# Altium schematic sheet MCPEmulate0.SchDoc
size A4; SheetNumber: 3; SheetTotal: 4
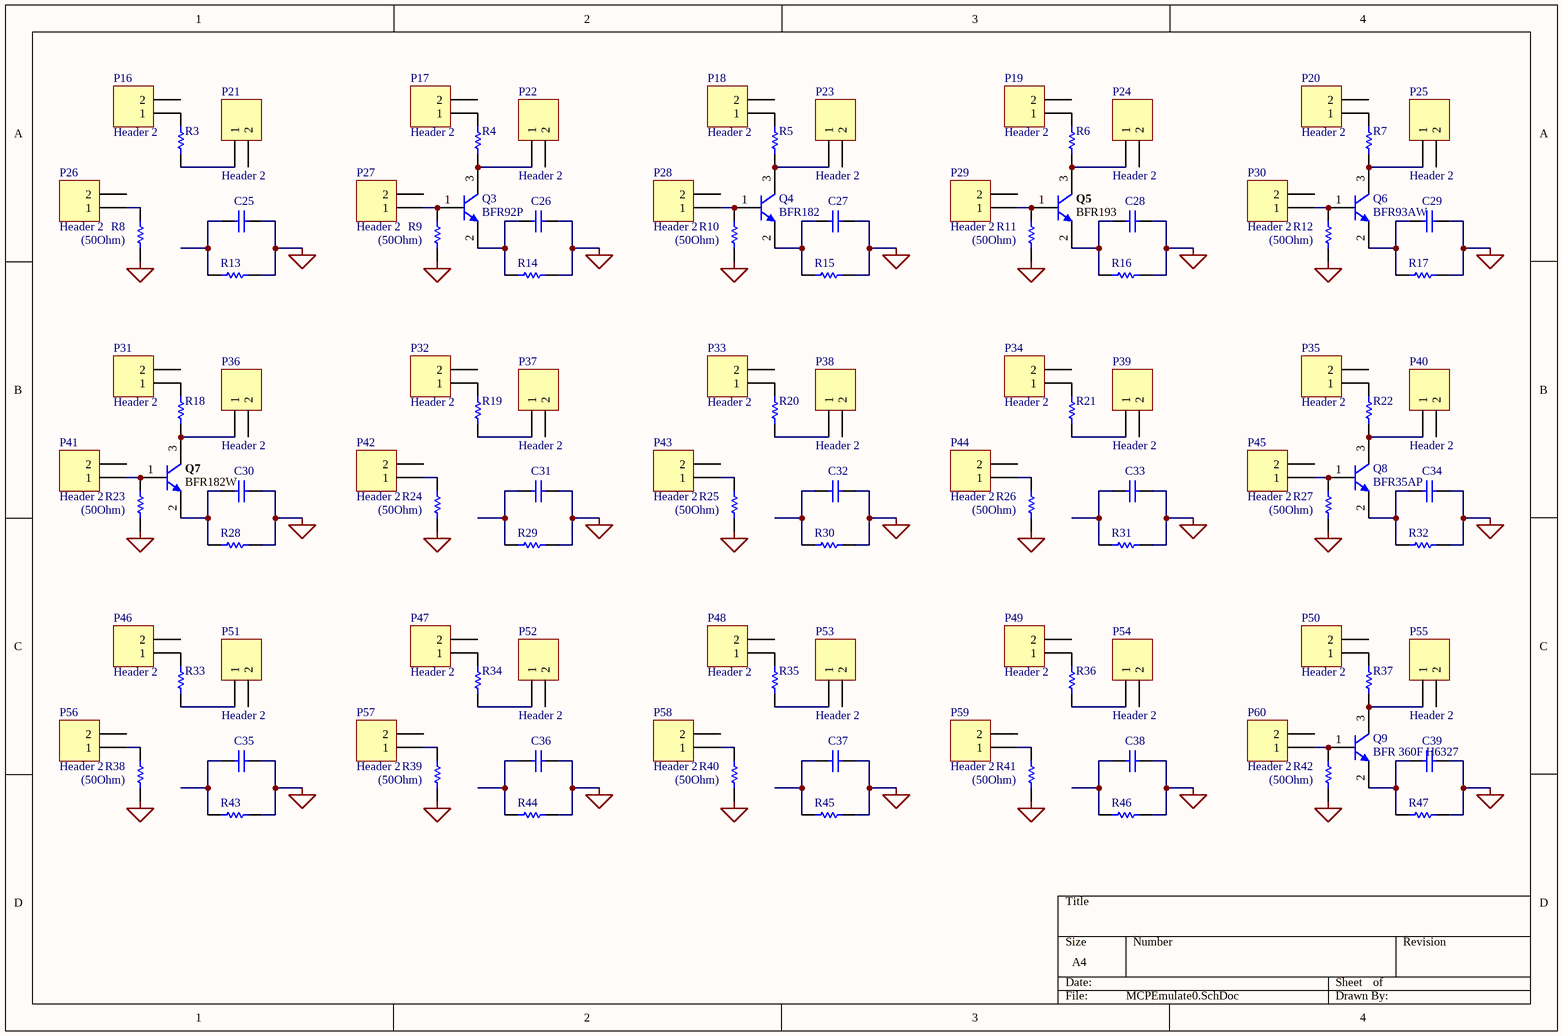
[diagram p0: MCPEmulate0.SchDoc]

## Parts
C25  (no value)  [CAPC2013X140X45NL15T25]
C26  (no value)  [CAPC2013X140X45NL15T25]
C27  (no value)  [CAPC2013X140X45NL15T25]
C28  (no value)  [CAPC2013X140X45NL15T25]
C29  (no value)  [CAPC2013X140X45NL15T25]
C30  (no value)  [CAPC2013X140X45NL15T25]
C31  (no value)  [CAPC2013X140X45NL15T25]
C32  (no value)  [CAPC2013X140X45NL15T25]
C33  (no value)  [CAPC2013X140X45NL15T25]
C34  (no value)  [CAPC2013X140X45NL15T25]
C35  (no value)  [CAPC2013X140X45NL15T25]
C36  (no value)  [CAPC2013X140X45NL15T25]
C37  (no value)  [CAPC2013X140X45NL15T25]
C38  (no value)  [CAPC2013X140X45NL15T25]
C39  (no value)  [CAPC2013X140X45NL15T25]
P16  Header 2  [HDR1X2]
P17  Header 2  [HDR1X2]
P18  Header 2  [HDR1X2]
P19  Header 2  [HDR1X2]
P20  Header 2  [HDR1X2]
P21  Header 2  [HDR1X2]
P22  Header 2  [HDR1X2]
P23  Header 2  [HDR1X2]
P24  Header 2  [HDR1X2]
P25  Header 2  [HDR1X2]
P26  Header 2  [HDR1X2]
P27  Header 2  [HDR1X2]
P28  Header 2  [HDR1X2]
P29  Header 2  [HDR1X2]
P30  Header 2  [HDR1X2]
P31  Header 2  [HDR1X2]
P32  Header 2  [HDR1X2]
P33  Header 2  [HDR1X2]
P34  Header 2  [HDR1X2]
P35  Header 2  [HDR1X2]
P36  Header 2  [HDR1X2]
P37  Header 2  [HDR1X2]
P38  Header 2  [HDR1X2]
P39  Header 2  [HDR1X2]
P40  Header 2  [HDR1X2]
P41  Header 2  [HDR1X2]
P42  Header 2  [HDR1X2]
P43  Header 2  [HDR1X2]
P44  Header 2  [HDR1X2]
P45  Header 2  [HDR1X2]
P46  Header 2  [HDR1X2]
P47  Header 2  [HDR1X2]
P48  Header 2  [HDR1X2]
P49  Header 2  [HDR1X2]
P50  Header 2  [HDR1X2]
P51  Header 2  [HDR1X2]
P52  Header 2  [HDR1X2]
P53  Header 2  [HDR1X2]
P54  Header 2  [HDR1X2]
P55  Header 2  [HDR1X2]
P56  Header 2  [HDR1X2]
P57  Header 2  [HDR1X2]
P58  Header 2  [HDR1X2]
P59  Header 2  [HDR1X2]
P60  Header 2  [HDR1X2]
Q3  BFR92P  [INF-SOT23_N]
Q4  BFR182  [INF-SOT23_M]
Q5  BFR193  [INF-SOT23_N]
Q6  BFR93AW  [INF-SOT323_M]
Q7  BFR182W  [INF-SOT323_L]
Q8  BFR35AP  [INF-SOT23_L]
Q9  BFR 360F H6327  [INF-PG-TSFP-3-1_V]
R3  (no value)  [RESC1005X40X25NL05T10]
R4  (no value)  [RESC1005X40X25NL05T10]
R5  (no value)  [RESC1005X40X25NL05T10]
R6  (no value)  [RESC1005X40X25NL05T10]
R7  (no value)  [RESC1005X40X25NL05T10]
R8  (50Ohm)  [RESC1005X40X25NL05T10]
R9  (50Ohm)  [RESC1005X40X25NL05T10]
R10  (50Ohm)  [RESC1005X40X25NL05T10]
R11  (50Ohm)  [RESC1005X40X25NL05T10]
R12  (50Ohm)  [RESC1005X40X25NL05T10]
R13  (no value)  [RESC1005X40X25NL05T10]
R14  (no value)  [RESC1005X40X25NL05T10]
R15  (no value)  [RESC1005X40X25NL05T10]
R16  (no value)  [RESC1005X40X25NL05T10]
R17  (no value)  [RESC1005X40X25NL05T10]
R18  (no value)  [RESC1005X40X25NL05T10]
R19  (no value)  [RESC1005X40X25NL05T10]
R20  (no value)  [RESC1005X40X25NL05T10]
R21  (no value)  [RESC1005X40X25NL05T10]
R22  (no value)  [RESC1005X40X25NL05T10]
R23  (50Ohm)  [RESC1005X40X25NL05T10]
R24  (50Ohm)  [RESC1005X40X25NL05T10]
R25  (50Ohm)  [RESC1005X40X25NL05T10]
R26  (50Ohm)  [RESC1005X40X25NL05T10]
R27  (50Ohm)  [RESC1005X40X25NL05T10]
R28  (no value)  [RESC1005X40X25NL05T10]
R29  (no value)  [RESC1005X40X25NL05T10]
R30  (no value)  [RESC1005X40X25NL05T10]
R31  (no value)  [RESC1005X40X25NL05T10]
R32  (no value)  [RESC1005X40X25NL05T10]
R33  (no value)  [RESC1005X40X25NL05T10]
R34  (no value)  [RESC1005X40X25NL05T10]
R35  (no value)  [RESC1005X40X25NL05T10]
R36  (no value)  [RESC1005X40X25NL05T10]
R37  (no value)  [RESC1005X40X25NL05T10]
R38  (50Ohm)  [RESC1005X40X25NL05T10]
R39  (50Ohm)  [RESC1005X40X25NL05T10]
R40  (50Ohm)  [RESC1005X40X25NL05T10]
R41  (50Ohm)  [RESC1005X40X25NL05T10]
R42  (50Ohm)  [RESC1005X40X25NL05T10]
R43  (no value)  [RESC1005X40X25NL05T10]
R44  (no value)  [RESC1005X40X25NL05T10]
R45  (no value)  [RESC1005X40X25NL05T10]
R46  (no value)  [RESC1005X40X25NL05T10]
R47  (no value)  [RESC1005X40X25NL05T10]

## Nets
GND: C25.1 C26.1 C27.1 C28.1 C29.1 C30.1 C31.1 C32.1 C33.1 C34.1 C35.1 C36.1 C37.1 C38.1 C39.1 R8.1 R9.1 R10.1 R11.1 R12.1 R13.1 R14.1 R15.1 R16.1 R17.1 R23.1 R24.1 R25.1 R26.1 R27.1 R28.1 R29.1 R30.1 R31.1 R32.1 R38.1 R39.1 R40.1 R41.1 R42.1 R43.1 R44.1 R45.1 R46.1 R47.1
NetC25_2: C25.2 R13.2
NetC26_2: C26.2 Q3.2(E) R14.2
NetC27_2: C27.2 Q4.2(E) R15.2
NetC28_2: C28.2 Q5.2(E) R16.2
NetC29_2: C29.2 Q6.2(E) R17.2
NetC30_2: C30.2 Q7.2(E) R28.2
NetC31_2: C31.2 R29.2
NetC32_2: C32.2 R30.2
NetC33_2: C33.2 R31.2
NetC34_2: C34.2 Q8.2(E) R32.2
NetC35_2: C35.2 R43.2
NetC36_2: C36.2 R44.2
NetC37_2: C37.2 R45.2
NetC38_2: C38.2 R46.2
NetC39_2: C39.2 Q9.2(E) R47.2
NetP16_1: P16.1 R3.1
NetP17_1: P17.1 R4.1
NetP18_1: P18.1 R5.1
NetP19_1: P19.1 R6.1
NetP20_1: P20.1 R7.1
NetP21_1: P21.1 R3.2
NetP22_1: P22.1 Q3.3(C) R4.2
NetP23_1: P23.1 Q4.3(C) R5.2
NetP24_1: P24.1 Q5.3(C) R6.2
NetP25_1: P25.1 Q6.3(C) R7.2
NetP26_1: P26.1 R8.2
NetP27_1: P27.1 Q3.1(B) R9.2
NetP28_1: P28.1 Q4.1(B) R10.2
NetP29_1: P29.1 Q5.1(B) R11.2
NetP30_1: P30.1 Q6.1(B) R12.2
NetP31_1: P31.1 R18.1
NetP32_1: P32.1 R19.1
NetP33_1: P33.1 R20.1
NetP34_1: P34.1 R21.1
NetP35_1: P35.1 R22.1
NetP36_1: P36.1 Q7.3(C) R18.2
NetP37_1: P37.1 R19.2
NetP38_1: P38.1 R20.2
NetP39_1: P39.1 R21.2
NetP40_1: P40.1 Q8.3(C) R22.2
NetP41_1: P41.1 Q7.1(B) R23.2
NetP42_1: P42.1 R24.2
NetP43_1: P43.1 R25.2
NetP44_1: P44.1 R26.2
NetP45_1: P45.1 Q8.1(B) R27.2
NetP46_1: P46.1 R33.1
NetP47_1: P47.1 R34.1
NetP48_1: P48.1 R35.1
NetP49_1: P49.1 R36.1
NetP50_1: P50.1 R37.1
NetP51_1: P51.1 R33.2
NetP52_1: P52.1 R34.2
NetP53_1: P53.1 R35.2
NetP54_1: P54.1 R36.2
NetP55_1: P55.1 Q9.3(C) R37.2
NetP56_1: P56.1 R38.2
NetP57_1: P57.1 R39.2
NetP58_1: P58.1 R40.2
NetP59_1: P59.1 R41.2
NetP60_1: P60.1 Q9.1(B) R42.2

Not connected (* = marked no-connect by the designer): P16 2; P17 2; P18 2; P19 2; P20 2; P21 2; P22 2; P23 2; P24 2; P25 2; P26 2; P27 2; P28 2; P29 2; P30 2; P31 2; P32 2; P33 2; P34 2; P35 2; P36 2; P37 2; P38 2; P39 2; P40 2; P41 2; P42 2; P43 2; P44 2; P45 2; P46 2; P47 2; P48 2; P49 2; P50 2; P51 2; P52 2; P53 2; P54 2; P55 2; P56 2; P57 2; P58 2; P59 2; P60 2

## Library data of the parts
C25-C39 = CMP-2007-03395-1: 0402; Part Number: GRM21BR71A106KE51L; Manufacturer: Murata
P16-P60 = Header 2: Header, 2-Pin; LatestRevisionDate: 17-Jul-2002; LatestRevisionNote: Re-released for DXP Platform.; Publisher: Altium Limited
Q3 = CMP-1191-00004-1: NPN Silicon RF Transistor, 15 V VCEO, 45 mA IC, 16 dB Gmax, SOT23, Green; Manufacturer: Infineon; VCEO (max): 15 V; Group: For low frequencies e.g. VHF/UHF; Ptot (max): 280 mW; NFmin (typ): 1.4 dB; Green: yes; IC (max): 45 mA; Gmax (typ): 16 dB; ComponentLink3URL: http://www.infineon.com/dgdl/SOT23-Package_Overview.pdf?folderId=db3a30431936bc4b0119532290053c66&fileId=db3a30431936bc4b0119533468123c85; ComponentLink2Description: Datasheet; ComponentLink1Description: Manufacturer URL; ComponentLink1URL: http://www.infineon.com/; PackageReference: SOT23; PartNumber: BFR92P; PackageDescription: 3-Pin Small Outline Transistor Package, 1.3 x 2.9 mm Body, 0.95 mm Pitch; ComponentLink3Description: Package Specification; Mounting Technology: Surface Mount; ComponentLink2URL: http://www.infineon.com/dgdl/bfr92p.pdf?folderId=db3a30431400ef68011425b1354605c1&fileId=db3a30431400ef68011426fd178506a6&location=en.Products.RF.RF_Transistors_.Low_Noise_Si_Transistors_up_to_2_5_GHz.DATASHEET.bfr92p.pdf; DatasheetVersion: Aug-2012
Q4 = CMP-1191-00008-1: NPN Silicon RF Transistor, 12 V VCEO, 35 mA IC, 18 dB Gmax, SOT23, Green; Manufacturer: Infineon; Group: For low frequencies e.g. VHF/UHF; Ptot (max): 250.0 mW; Gmax (typ): 18 dB; NFmin (typ): 0.9 dB; IC (max): 35 mA; VCEO (max): 12 V; Green: yes; Mounting Technology: Surface Mount; DatasheetVersion: Mar-2007; ComponentLink2URL: http://www.infineon.com/dgdl/bfr182.pdf?folderId=db3a30431400ef68011425b1354605c1&fileId=db3a30431400ef680114268f4d130640&location=en.Products.RF.RF_Transistors_.Low_Noise_Si_Transistors_up_to_2_5_GHz.DATASHEET.bfr182.pdf; ComponentLink2Description: Datasheet; PackageDescription: 3-Pin Small Outline Transistor Package, 1.3 x 2.9 mm Body, 0.95 mm Pitch; ComponentLink3Description: Package Specification; PackageReference: SOT23; PartNumber: BFR182; ComponentLink1Description: Manufacturer URL; ComponentLink3URL: http://www.infineon.com/dgdl/SOT23-Package_Overview.pdf?folderId=db3a30431936bc4b0119532290053c66&fileId=db3a30431936bc4b0119533468123c85; ComponentLink1URL: http://www.infineon.com/
Q5 = CMP-1189-00003-1: NPN Silicon RF Transistor, 12 V VCEO, 80 mA IC, 15 dB Gmax, SOT23, Green; Manufacturer: Infineon; Gmax (typ): 15 dB; VCEO (max): 12 V; IC (max): 80 mA; NFmin (typ): 1 dB; Green: yes; Ptot (max): 580.0 mW; Group: For low frequencies, e.g. VHF/UHF; PackageDescription: 3-Pin Small Outline Transistor Package, 1.3 x 2.9 mm Body, 0.95 mm Pitch; ComponentLink1URL: http://www.infineon.com/; ComponentLink1Description: Manufacturer URL; PackageReference: SOT23; ComponentLink2Description: Datasheet; PartNumber: BFR193; Mounting Technology: Surface Mount; ComponentLink3URL: http://www.infineon.com/dgdl/SOT23-Package_Overview.pdf?folderId=db3a30431936bc4b0119532290053c66&fileId=db3a30431936bc4b0119533468123c85; ComponentLink2URL: http://www.infineon.com/dgdl/bfr193.pdf?folderId=db3a30431400ef68011425b1354605c1&fileId=db3a30431400ef68011426adab31066c&location=en.Products.RF.RF_Transistors_.High_Linearity_Si-_and_SiGe_C-Transistors_for_use_up_to_6_GHz.DATASHEET.bfr193.pdf; DatasheetVersion: Aug-2012; ComponentLink3Description: Package Specification
Q6 = CMP-1189-00009-1: NPN Silicon RF Transistor, 12 V VCEO, 90 mA IC, 15.5 dB Gmax, SOT323, Green; Manufacturer: Infineon; IC (max): 90 mA; NFmin (typ): 1.5 dB; Gmax (typ): 15.5 dB; Group: For low frequencies, e.g. VHF/UHF; VCEO (max): 12 V; Ptot (max): 300mW; Green: yes; ComponentLink3Description: Package Specification; PartNumber: BFR93AW; ComponentLink2URL: http://www.infineon.com/dgdl/Infineon_LNA_BFR93AW.pdf?folderId=db3a30431400ef68011425b1354605c1&fileId=db3a30431441fb5d0114acaaec8c148f&location=en.Products.RF.RF_Transistors_.High_Linearity_Si-_and_SiGe_C-Transistors_for_use_up_to_6_GHz.DATASHEET.Infineon; ComponentLink3URL: http://www.infineon.com/dgdl/SOT323-Package_Overview.pdf?folderId=db3a30431936bc4b0119533e1dcb3c92&fileId=db3a30431936bc4b011953495f283cb1; ComponentLink2Description: Datasheet; Halogen-free: yes; ComponentLink1URL: http://www.infineon.com/; PackageReference: SOT323; PackageDescription: 3-Pin Small Outline Transistor Package, 1.25 x 2 mm Body, 0.65 mm Pitch; ComponentLink1Description: Manufacturer URL; Mounting Technology: Surface Mount; DatasheetVersion: Jul-2012
Q7 = CMP-1191-00013-1: NPN Silicon RF Transistor, 12 V VCEO, 35 mA IC, 19 dB Gmax, SOT323, Green; Manufacturer: Infineon; Ptot (max): 250mW; Green: yes; Gmax (typ): 19 dB; IC (max): 35 mA; NFmin (typ): 0.9 dB; VCEO (max): 12 V; Group: For low frequencies e.g. VHF/UHF; ComponentLink1Description: Manufacturer URL; PackageReference: SOT323; DatasheetVersion: Apr-2010; PackageDescription: 3-Pin Small Outline Transistor Package, 1.25 x 2 mm Body, 0.65 mm Pitch; Mounting Technology: Surface Mount; ComponentLink2URL: http://www.infineon.com/dgdl/bfr182w.pdf?folderId=db3a30431400ef68011425b1354605c1&fileId=db3a30431400ef680114269d1e43064c&location=en.Products.RF.RF_Transistors_.Low_Noise_Si_Transistors_up_to_2_5_GHz.DATASHEET.bfr182w.pdf; ComponentLink3Description: Package Specification; PartNumber: BFR182W; Halogen-free: yes; ComponentLink1URL: http://www.infineon.com/; ComponentLink2Description: Datasheet; ComponentLink3URL: http://www.infineon.com/dgdl/SOT323-Package_Overview.pdf?folderId=db3a30431936bc4b0119533e1dcb3c92&fileId=db3a30431936bc4b011953495f283cb1
Q8 = CMP-1191-00003-1: NPN Silicon RF Transistor, 15 V VCEO, 45 mA IC, 16 dB Gmax, SOT23, Green; Manufacturer: Infineon; Ptot (max): 280 mW; Group: For low frequencies e.g. VHF/UHF; Gmax (typ): 16 dB; IC (max): 45 mA; VCEO (max): 15 V; Green: yes; NFmin (typ): 1.4 dB; PackageReference: SOT23; PartNumber: BFR35AP; ComponentLink3Description: Package Specification; Mounting Technology: Surface Mount; ComponentLink3URL: http://www.infineon.com/dgdl/SOT23-Package_Overview.pdf?folderId=db3a30431936bc4b0119532290053c66&fileId=db3a30431936bc4b0119533468123c85; ComponentLink1URL: http://www.infineon.com/; ComponentLink1Description: Manufacturer URL; ComponentLink2URL: http://www.infineon.com/dgdl/bfr35ap.pdf?folderId=db3a30431400ef68011425b1354605c1&fileId=db3a30431400ef68011426b8f826067e&location=en.Products.RF.RF_Transistors_.Low_Noise_Si_Transistors_up_to_2_5_GHz.DATASHEET.bfr35ap.pdf; ComponentLink2Description: Datasheet; DatasheetVersion: Aug-2012; PackageDescription: 3-Pin Small Outline Transistor Package, 1.3 x 2.9 mm Body, 0.95 mm Pitch
Q9 = CMP-2000-05948-1: Low Noise Silicon Bipolar RF Transistor, 9 V, 3-Pin TSFP, RoHS, Tape and Reel; Manufacturer: Infineon; Voltage - Collector Emitter Breakdown (Max): 9V; Gain: 15.5dB; PCN Packaging: RecyclableGlassCarrier14/Oct/2014; Other Names: BFR360FH6327CT; Noise Figure (dB Typ @ f): 1dB@1.8GHz; Online Catalog: NPNRFTransistors; Power - Max: 210mW; Transistor Type: NPN; DC Current Gain (hFE) (Min) @ Ic, Vce: 90@15mA,3V; Current - Collector (Ic) (Max): 35mA; Frequency - Transition: 14GHz; Category: DiscreteSemiconductorProducts; Mounting Type: SurfaceMount; Packaging: CutTape(CT); Mounting Technology: SurfaceMount; Series: -; Package / Case: SOT-723; Datasheet Version: 11/2013; Family: RFTransistors(BJT); Package Description: 3-Pin Small Outline Transistor, Flat Lead, Body 1.2 x 0.8 mm, Pitch 0.4 mm; Package Reference: PG-TSFP-3-1; Manufacturer URL: http://www.infineon.com/; Standard Package: 1; Datasheet URL: http://www.infineon.com/dgdl/bfr360f.pdf?folderId=db3a30431400ef68011425b1354605c1&fileId=db3a30431400ef68011426bc17c4067f; Supplier Device Package: PG-TSFP-3
R3-R47 = CMP-2002-07472-1: 0402; Part Number: RC0402FR-071KL; Manufacturer: Yageo / Phycomp